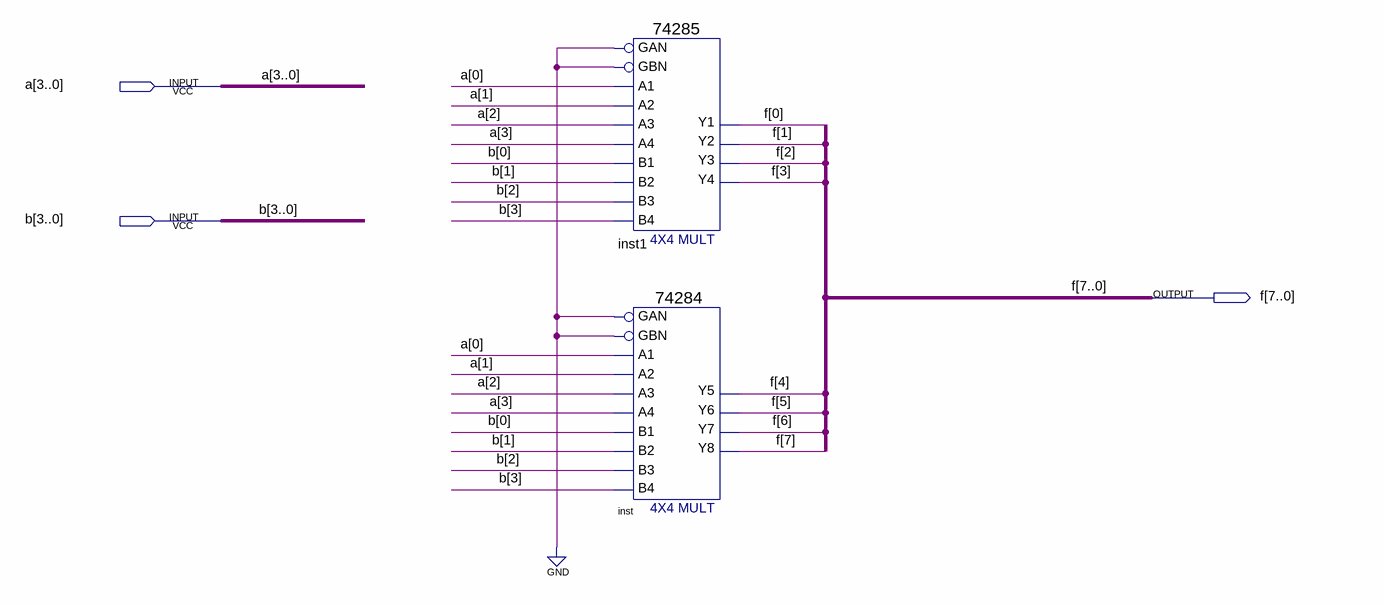
[diagram p0: schematic sheet]
// Quartus schematic Mul_unit.bdf as structural Verilog: 2 symbols, 3 pins
module Mul_unit (
  input  [3:0] a,
  input  [3:0] b,
  output [7:0] f
);

  \74285  inst1 (
    .GBN(1'b0), .GAN(1'b0), .A1(a[0]), .A2(a[1]), .A3(a[2]), .B2(b[1]), .B1(b[0]), .A4(a[3]), .B4(b[3]),
    .B3(b[2]), .Y4(f[3]), .Y1(f[0]), .Y2(f[1]), .Y3(f[2]));
  \74284  inst (
    .GAN(1'b0), .A2(a[1]), .A1(a[0]), .GBN(1'b0), .B1(b[0]), .A4(a[3]), .A3(a[2]), .B4(b[3]), .B3(b[2]),
    .B2(b[1]), .Y8(f[7]), .Y6(f[5]), .Y7(f[6]), .Y5(f[4]));
endmodule
